# Altium schematic sheet MCU.SchDoc
size A4; Organization: Altium Limited; Address1: L3, 12a Rodborough Rd; Address2: Frenchs Forest; Address3: NSW; Address4: Australia 2086
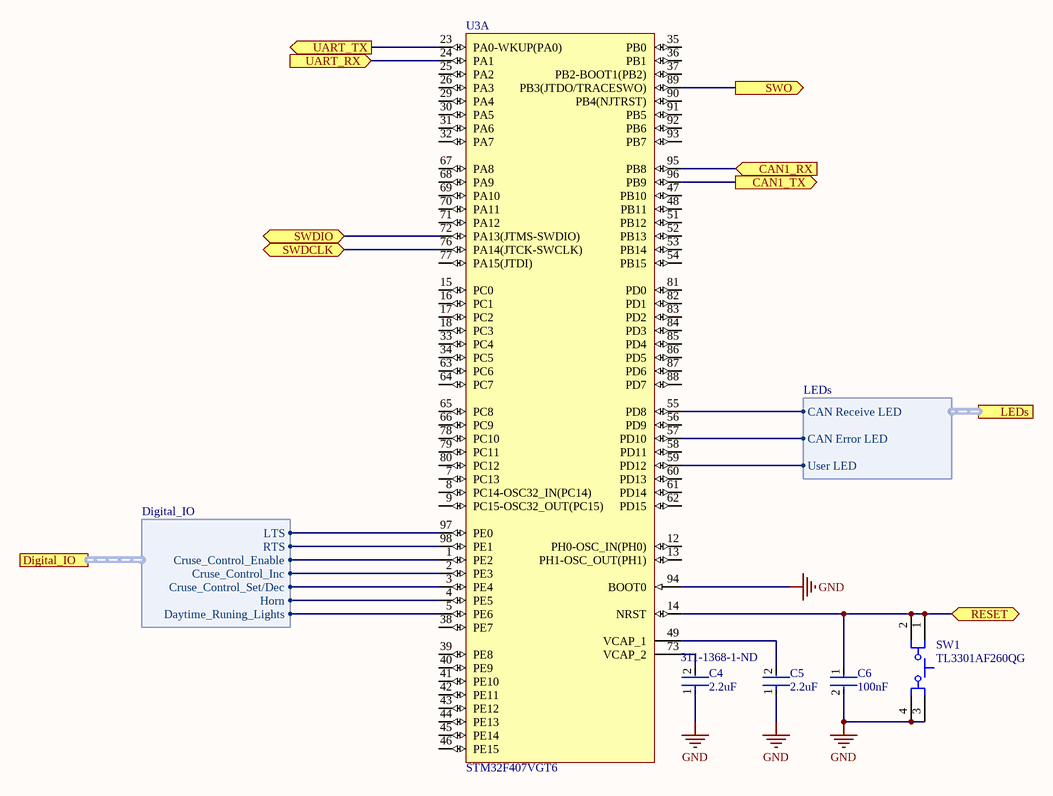
[diagram p0: MCU.SchDoc]

## Parts
C4  2.2uF  Supplier Part Number 1: 311-1368-1-ND  [Yageo_CC0805-0.85_IPC_A]
C5  2.2uF  [Yageo_CC0805-0.85_IPC_A]
C6  100nF  [Kemet_C0603_IPC_A]
SW1  TL3301AF260QG  [ESWI-TL3301AF260QG_V]
U3  STM32F407VGT6  [STM-LQFP100_M]  (part A of 2)

## Ports
CAN1_RX (in), CAN1_TX (out), Digital_IO (harness Digital_IO), LEDs (harness LEDs), RESET (bidir), SWDCLK (bidir), SWDIO (bidir), SWO (out), UART_RX (in), UART_TX (out)

## Harnesses
LEDs: CAN Error LED, CAN Receive LED, User LED
Digital_IO: LTS, RTS, Cruse_Control_Enable, Cruse_Control_Inc, Cruse_Control_Set/Dec, Horn, Daytime_Runing_Lights

## Nets
GND: C4.1 C5.1 C6.2 SW1.3 SW1.4 U3.94(BOOT0)
CAN1_RX: U3.95(PB8) ; port CAN1_RX
CAN1_TX: U3.96(PB9) ; port CAN1_TX
RESET: C6.1 SW1.1 SW1.2 U3.14(NRST) ; port RESET
SWDCLK: U3.76(PA14(JTCK-SWCLK)) ; port SWDCLK
SWDIO: U3.72(PA13(JTMS-SWDIO)) ; port SWDIO
SWO: U3.89(PB3(JTDO/TRACESWO)) ; port SWO
UART_RX: U3.24(PA1) ; port UART_RX
UART_TX: U3.23(PA0-WKUP(PA0)) ; port UART_TX
NetC4_2: C4.2 U3.73(VCAP_2)
NetC5_2: C5.2 U3.49(VCAP_1)
NetU3_1: U3.1(PE2) ; port Digital_IO.Cruse_Control_Enable
NetU3_2: U3.2(PE3) ; port Digital_IO.Cruse_Control_Inc
NetU3_3: U3.3(PE4) ; port Digital_IO.Cruse_Control_Set/Dec
NetU3_4: U3.4(PE5) ; port Digital_IO.Horn
NetU3_5: U3.5(PE6) ; port Digital_IO.Daytime_Runing_Lights
NetU3_55: U3.55(PD8) ; port LEDs.CAN Receive LED
NetU3_57: U3.57(PD10) ; port LEDs.CAN Error LED
NetU3_59: U3.59(PD12) ; port LEDs.User LED
NetU3_97: U3.97(PE0) ; port Digital_IO.LTS
NetU3_98: U3.98(PE1) ; port Digital_IO.RTS

Not connected (* = marked no-connect by the designer): U3 7(PC13) 8(PC14-OSC32_IN(PC14)) 9(PC15-OSC32_OUT(PC15)) 12(PH0-OSC_IN(PH0)) 13(PH1-OSC_OUT(PH1)) 15(PC0) 16(PC1) 17(PC2) 18(PC3) 25(PA2) 26(PA3) 29(PA4) 30(PA5) 31(PA6) 32(PA7) 33(PC4) 34(PC5) 35(PB0) 36(PB1) 37(PB2-BOOT1(PB2)) 38(PE7) 39(PE8) 40(PE9) 41(PE10) 42(PE11) 43(PE12) 44(PE13) 45(PE14) 46(PE15) 47(PB10) 48(PB11) 51(PB12) 52(PB13) 53(PB14) 54(PB15) 56(PD9) 58(PD11) 60(PD13) 61(PD14) 62(PD15) 63(PC6) 64(PC7) 65(PC8) 66(PC9) 67(PA8) 68(PA9) 69(PA10) 70(PA11) 71(PA12) 77(PA15(JTDI)) 78(PC10) 79(PC11) 80(PC12) 81(PD0) 82(PD1) 83(PD2) 84(PD3) 85(PD4) 86(PD5) 87(PD6) 88(PD7) 90(PB4(NJTRST)) 91(PB5) 92(PB6) 93(PB7)

## Notes on the sheet
- Title
- Size:
- Date:
- A4
- Number:
- Time:
- Revision:
- Sheet
- of
- File:

## Library data of the parts
C4 = CC0805KKX7R6BB225: 2.2UF CC0805KKX7R6BB225; Manufacturer 1: Yageo; Dielectric Material: Ceramic; Tolerance: 10%; Dielectric: X7R; Voltage Rating: 10V; Supplier 1: Digi-Key; Manufacturer Part Number 1: CC0805KKX7R6BB225; Stock 1: 101677; Pricing 1: 1=0.25000, 10=0.17200, 100=0.09760, 500=0.06890, 1000=0.06029 (USD); RoHS: Yes; Mount: Surface Mount; Case/Package: 0805; Weight: 0.000194oz; Case Code (Metric): 2012; Case Code (Imperial): 0805; Min Operating Temperature: -55°C; Max Operating Temperature: 125°C; Capacitance: 2.2uF; Voltage Rating (DC): 10V; Packaging: Tape and Reel; Package Quantity: 1; Termination: SMD/SMT; Composition: Ceramic; Length: 2mm; Height: 1.25mm; Width: 0.049inch; Thickness: 0.049inch; Depth: 1.25mm; Radiation Hardening: No; REACH SVHC: Unknown; Lead Free: Lead Free; Halogen Free: Halogen Free; ComponentLink1URL: https://datasheet.ciiva.com/5789/1734573-5789888.pdf?src-supplier=Farnell; ComponentLink1Description: https://datasheet.ciiva.com/5789/1734573-5789888.pdf?src-supplier=Farnell; ComponentLink2URL: https://datasheet.ciiva.com/161/mlccorderingcode-161925.pdf?src-supplier=Digi-Key; ComponentLink2Description: https://datasheet.ciiva.com/161/mlccorderingcode-161925.pdf?src-supplier=Digi-Key; ComponentLink3URL: https://datasheet.ciiva.com/15189/getdatasheetpartid-315916-15189205.pdf?src-supplier=Verical; ComponentLink3Description: https://datasheet.ciiva.com/15189/getdatasheetpartid-315916-15189205.pdf?src-supplier=Verical; ComponentLink4URL: https://datasheet.ciiva.com/161/mlccorderingcode-161926.pdf?src-supplier=Digi-Key; ComponentLink4Description: https://datasheet.ciiva.com/161/mlccorderingcode-161926.pdf?src-supplier=Digi-Key; ComponentLink5URL: https://datasheet.ciiva.com/161/mlccorderingcode-161927.pdf?src-supplier=Digi-Key; ComponentLink5Description: https://datasheet.ciiva.com/161/mlccorderingcode-161927.pdf?src-supplier=Digi-Key; ComponentLink6URL: https://datasheet.ciiva.com/8033/70765-8033975.pdf?src-supplier=Element14; ComponentLink6Description: https://datasheet.ciiva.com/8033/70765-8033975.pdf?src-supplier=Element14; ComponentLink7URL: https://datasheet.ciiva.com/8033/1734573-8033977.pdf?src-supplier=Element14; ComponentLink7Description: https://datasheet.ciiva.com/8033/1734573-8033977.pdf?src-supplier=Element14; ComponentLink8URL: https://datasheet.ciiva.com/13208/upy-gphc-x7r-6-3v-to-50v-8-12304-13208665.pdf?src-supplier=Mouser; ComponentLink8Description: https://datasheet.ciiva.com/13208/upy-gphc-x7r-6-3v-to-50v-8-12304-13208665.pdf?src-supplier=Mouser; ComponentLink9URL: https://datasheet.ciiva.com/8033/1734573-8033979.pdf?src-supplier=Element14; ComponentLink9Description: https://datasheet.ciiva.com/8033/1734573-8033979.pdf?src-supplier=Element14; ComponentLink10URL: https://datasheet.ciiva.com/16624/upy-gphc-x7r-6-3v-to-50v-8-16624651.pdf?src-supplier=Avnet+Europe; ComponentLink10Description: https://datasheet.ciiva.com/16624/upy-gphc-x7r-6-3v-to-50v-8-16624651.pdf?src-supplier=Avnet+Europe; ComponentLink11URL: https://datasheet.ciiva.com/11587/upy-gphc-x7r-6-3v-to-50v-8-11587213.pdf?src-supplier=Avnet; ComponentLink11Description: https://datasheet.ciiva.com/11587/upy-gphc-x7r-6-3v-to-50v-8-11587213.pdf?src-supplier=Avnet
C5 = CC0805KKX7R6BB225: 2.2UF CC0805KKX7R6BB225
C6 = C0603C104K5RACTU: CAP CER 0.1UF 100NF 50V X7R 0603 C0603C104K5RACTU
SW1 = CMP-2000-07249-1: Tactile Switch, SPST-NO, 50 mA, 12 V, -20 to 70 degC, 4-Pin SMD, RoHS, Tape and Reel; Manufacturer: E-Switch; Catalog Drawings: TL3301xFFootprint; Contact Rating @ Voltage: 0.05A@12VDC; Featured Product: TL3301SeriesTactSwitch; Mechanical Life: 100,000Cycles; Product Training Modules: SwitchBasics; Actuator Orientation: TopActuated; Switch Travel: 0.25mm; Other Names: EG2527DKR; 3D Model: TL3301AFyyyyG.stp; Illumination: Non-Illuminated; Switch Function: Off-Mom; Online Catalog: TL3301Series; Outline: 6.00mmx6.00mm; Package Version: Rev. D, 10/2014; Operating Force: 260gf; Actuator Material: Polyamide(PA),Nylon; Actuator Type: Standard; Actuator Height off PCB, from Pins: 5.00mm; Packaging: Digi-Reel®; Standard Package: 1; Datasheet URL: https://www.e-switch.com/system/asset/product_line/data_sheet/185/TL3301.pdf; Family: TactileSwitches; Mounting Technology: SurfaceMount; Illumination Type, Color: -; Manufacturer URL: http://www.e-switch.ch/en/; RoHS Information: TL3301SeriesRoHSCertofCompliance; Ingress Protection: -; Package URL: http://spec_sheets.e-switch.com/specs/P010513.pdf; Illumination Voltage (Nominal): -; Operating Temperature: -20°C~70°C; Series: TL3301; Termination Style: GullWing; Category: Switches; Mounting Type: SurfaceMount; Package Description: 4-Pin Surface Mount Device, Body 6 x 6 mm; Features: -; Circuit: SPST-NO; Package Reference: TL3301AF260QG; Datasheet Version: 12/2013
U3 = CMP-0243-00017-3: ARM Cortex-M4 32-bit MCU+FPU, 210 DMIPS, 1024 kB Flash, 192 kB Internal RAM, 82 I/Os, 100-pin LQFP, -40 to 85 degC, Tray; Manufacturer: STMicroelectronics; Supply Voltage(Vcc) min (V): 1.8; Supply Voltage(Vcc) max (V): 3.6; I/Os (High Current): 82; Operating Frequency(F) (Processor speed) (MHz): 168; D/A Converter: 2x12-bit; FLASH Size (Prog) (kB): 1024; Internal RAM Size (kB): 192; PackageDescription: 100-Pin Low Profile Quad Flat Package, 14 x 14 mm Body, 0.5 mm Pitch; ComponentLink3URL: http://www.st.com/st-web-ui/static/active/en/resource/technical/document/data_brief/DM00071938.pdf; PackageVersion: Rev. 1, 06/2013; PackageReference: LQFP100; PartNumber: STM32F407VGT6; ComponentLink1Description: Manufacturer URL; ComponentLink2URL: http://www.st.com/st-web-ui/static/active/en/resource/technical/document/datasheet/DM00037051.pdf; DatasheetVersion: Rev. 4; ComponentLink3Description: Package Specification; Core: ARM Cortex-M4; ComponentLink2Description: Datasheet; Mounting Technology: Surface Mount; ComponentLink1URL: http://www.st.com/web/en/home.html; Packing: Tray